# Altium schematic sheet v1.0.SchDoc
size 76 x 40 mm
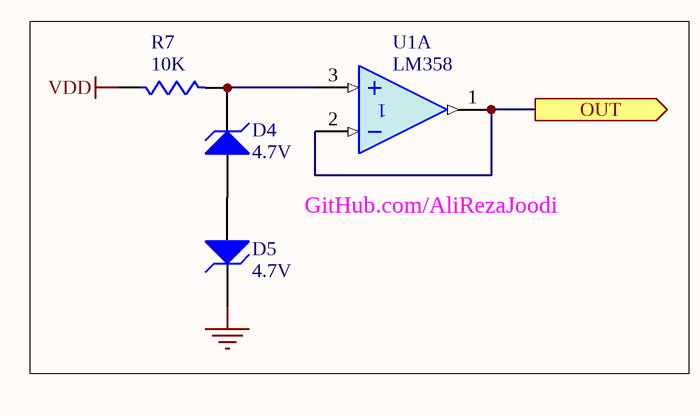
[diagram p0: v1.0.SchDoc]

## Parts
D4  4.7V  [DIODE0.4_Glass]
D5  4.7V  [DIODE0.4_Glass]
R7  10K  [AXIAL-0.4]
U1  LM358  [DIP_8]  (part A of 3)

## Ports
OUT (out)

## Nets
GND: D5.2(K)
VDD: R7.1
OUT: U1.1(OUT) U1.2(IN-) ; port OUT
NetD4_1: D4.1(A) D5.1(A)
NetD4_2: D4.2(K) R7.2 U1.3(IN+)

## Notes on the sheet
- GitHub.com/AliRezaJoodi

## Library data of the parts
D4 D5 = D Zener: Zener Diode; Manufacturer: Generic Components; Class I: Discrete; Class II: Diode - Zener; Published: 8-Jun-2000; Revision: July-2002: Re-released for DXP Platform.; Publisher: Altium Limited
R7 = Res1: Resistor; Manufacturer: Generic Components; Class I: Passive; Published: 8-Jun-2000; Revision: July-2002: Re-released for DXP Platform.; Publisher: Altium Limited; Class II: Resistor
U1 = LM358: Dual Low-Power Operational Amplifier; Published: 17-Jul-2002; LatestRevisionDate: 13-Apr-2006; LatestRevisionNote: IPC-7351 Footprint Added.; DatasheetVersion: 1988; PackageReference: 751-02; Publisher: Altium Limited; PackageDescription: 8-Pin Small Outline Integrated Circuit 1.27 mm Pitch; Code_JEDEC: MS-012-AA; Code_IPC: SOIC127P600-8; ComponentLink1Description: Manufacturer Link; ComponentLink1URL: http://www.onsemi.com/site/products/parametrics/0,4446,251,00.html; ComponentLink2Description: Datasheet; ComponentLink2URL: http://www.onsemi.com/pub/Collateral/LM358-D.PDF